# Altium schematic sheet Stepper.SchDoc
size A4
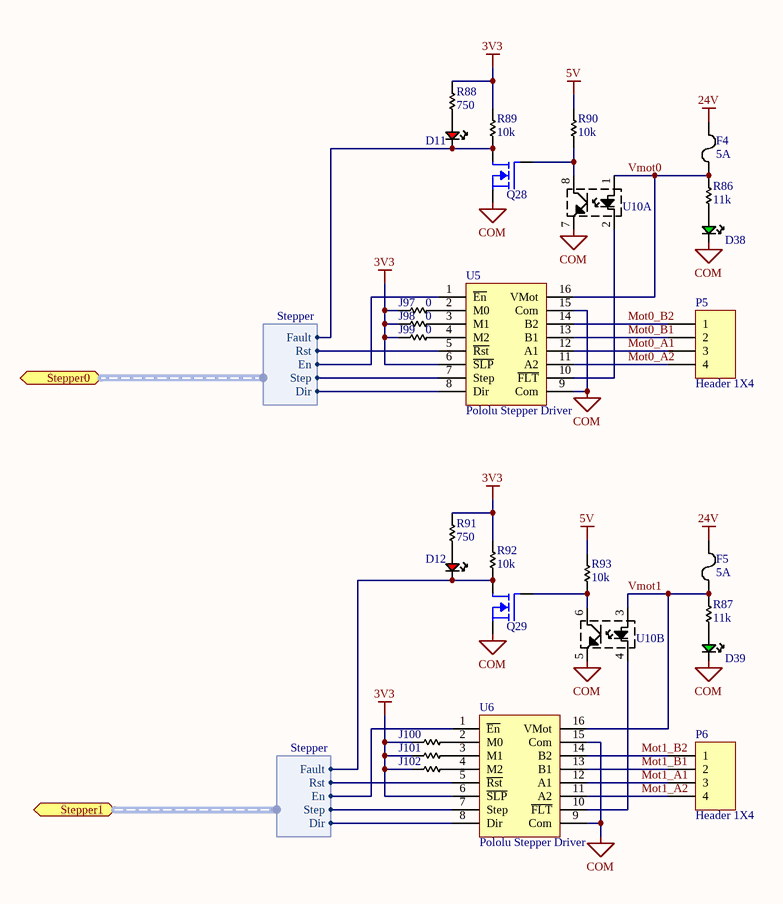
[diagram p0: Stepper.SchDoc]

## Parts
D11  Red  [0805 - Led Red]  (value not drawn)
D12  Red  [0805 - Led Red]  (value not drawn)
D38  Green  [0603 - Led Green]  (value not drawn)
D39  Green  [0603 - Led Green]  (value not drawn)
F4  value 5A  [Fuse - 1206]  (hidden comment: Fuse)
F5  value 5A  [Fuse - 1206]  (hidden comment: Fuse)
J97  value 0  [0805 - Resistor]  (hidden comment: Res)
J98  value 0  [0805 - Resistor]  (hidden comment: Res)
J99  value 0  [0805 - Resistor]  (hidden comment: Res)
J100  Res  [0805 - Resistor]  (value not drawn)
J101  Res  [0805 - Resistor]  (value not drawn)
J102  Res  [0805 - Resistor]  (value not drawn)
P5  Header 1X4  [Headers - 1x4 - Vertical - Lock]
P6  Header 1X4  [Headers - 1x4 - Vertical - Lock]
Q28  MOSFET_N  [SOT23-3]  (value not drawn)
Q29  MOSFET_N  [SOT23-3]  (value not drawn)
R86  value 11k  [0805 - Resistor]  (hidden comment: Res)
R87  value 11k  [0805 - Resistor]  (hidden comment: Res)
R88  value 750  [0805 - Resistor]  (hidden comment: Res)
R89  value 10k  [0805 - Resistor]  (hidden comment: Res)
R90  value 10k  [0805 - Resistor]  (hidden comment: Res)
R91  value 750  [0805 - Resistor]  (hidden comment: Res)
R92  value 10k  [0805 - Resistor]  (hidden comment: Res)
R93  value 10k  [0805 - Resistor]  (hidden comment: Res)
U5  Pololu Stepper Driver  [Pololu - DRV8825 - socket]
U6  Pololu Stepper Driver  [Pololu - DRV8825 - socket]
U10  LTV-827S-TA1  [8-SMD - GullWing]  (value not drawn)  (parts A,B of 2)

## Ports
Stepper0 (harness Stepper), Stepper1 (harness Stepper)

## Harnesses
Stepper: Dir, Step, En, Rst, Fault

## Nets
3V3: J97.2 J98.2 J99.2 J100.2 J101.2 J102.2 R88.2 R89.1 R91.2 R92.1 U5.6(~{SLP}) U6.6(~{SLP})
5V: R90.1 R93.1
24V: F4.1 F5.1
COM: D38.2(K) D39.2(K) Q28.2(S) Q29.2(S) U5.9(Com) U5.15(Com) U6.9(Com) U6.15(Com) U10.5(E2) U10.7(E1)
Mot0_A1: P5.3 U5.12(A1)
Mot0_A2: P5.4 U5.11(A2)
Mot0_B1: P5.2 U5.13(B1)
Mot0_B2: P5.1 U5.14(B2)
Mot1_A1: P6.3 U6.12(A1)
Mot1_A2: P6.4 U6.11(A2)
Mot1_B1: P6.2 U6.13(B1)
Mot1_B2: P6.1 U6.14(B2)
Vmot0: F4.2 R86.2 U5.16(VMot) U10.1(A1)
Vmot1: F5.2 R87.2 U6.16(VMot) U10.3(A2)
NetD11_1: D11.1(A) R88.1
NetD11_2: D11.2(K) Q28.3(D) R89.2 ; port Stepper0.Fault
NetD12_1: D12.1(A) R91.1
NetD12_2: D12.2(K) Q29.3(D) R92.2 ; port Stepper1.Fault
NetD38_1: D38.1(A) R86.1
NetD39_1: D39.1(A) R87.1
NetJ97_1: J97.1 U5.2(M0)
NetJ98_1: J98.1 U5.3(M1)
NetJ99_1: J99.1 U5.4(M2)
NetJ100_1: J100.1 U6.2(M0)
NetJ101_1: J101.1 U6.3(M1)
NetJ102_1: J102.1 U6.4(M2)
NetQ28_1: Q28.1(G) R90.2 U10.8(C1)
NetQ29_1: Q29.1(G) R93.2 U10.6(C2)
NetU5_1: U5.1(~{En}) ; port Stepper0.En
NetU5_5: U5.5(~{Rst}) ; port Stepper0.Rst
NetU5_7: U5.7(Step) ; port Stepper0.Step
NetU5_8: U5.8(Dir) ; port Stepper0.Dir
NetU5_10: U5.10(~{FLT}) U10.2(K1)
NetU6_1: U6.1(~{En}) ; port Stepper1.En
NetU6_5: U6.5(~{Rst}) ; port Stepper1.Rst
NetU6_7: U6.7(Step) ; port Stepper1.Step
NetU6_8: U6.8(Dir) ; port Stepper1.Dir
NetU6_10: U6.10(~{FLT}) U10.4(K2)

## Library data of the parts
D11 D12 = LED-Red-2mA-lowBrigthness-0805: LED 630NM RED WTR CLR 0805 SMD; Manufacturer: Rohm semiconductor; Manufacturer No: SML-211UTT86; Sub Category: 0805; Voltage: 1.8V; Current: 2mA; Part Number: LED-Red-2mA-lowBrigthness-0805; Category: LED; Pin count: 2; Package: 0805; Supplier 1: Digi-Key; Supplier Part Number 1: 511-1292-1-ND; ComponentLink1URL: http://rohmfs.rohm.com/en/products/databook/datasheet/opto/led/chip_mono/sml-21.pdf; ComponentLink1Description: Datasheet; Creation Date: 2013-11-19 15:30:55; Created by: Pier-Yves; Value: red; Height: 0.8mm
D38 D39 = LED-Green-2mA-lowBrigthness-0603: LED SMARTLED GREEN 570NM 0603; Manufacturer: OSRAM Opto Semiconductor; Manufacturer No: LG L29K-G2J1-24-Z; Sub Category: 0603; Value: 3.92 mcd; Voltage: 1.7V; Current: 2mA; Part Number: LED-Green-2mA-lowBrigthness-0603; Category: LED; Pin count: 2; Package: 0603; Series: SmartLED; Supplier 1: Digi-Key; Supplier Part Number 1: 475-2709-1-ND; ComponentLink1URL: http://catalog.osram-os.com/catalogue/catalogue.do;jsessionid=32CB61882C089EDD4B6D0A54E7E1F117?act=downloadFile&favOid=020000020000138e000100b6; ComponentLink1Description: Datasheet; Creation Date: 2013-11-17 11:13:55; Created by: Pier-Yves; Height: 0.65mm
F4 F5 = Fuse-1206-Bourns-Slow-SinglFuse_SF-1206S-5A: FUSE SLOW 24VDC 5A 1206; Manufacturer: Bourns Inc.; Manufacturer No: SF-1206S500-2; Sub Category: 1206 SlowBlow; Voltage: 63VDC; Part Number: Fuse-1206-Bourns-Slow-SinglFuse_SF-1206S-5A; Category: Fuse; Pin count: 2; Package: 1206; Series: SinglFuse SF-1206S; Supplier 1: Digi-Key; Supplier Part Number 1: SF-1206S500-2CT-ND; ComponentLink1URL: http://www.bourns.com/data/global/pdfs/sf1206s.pdf; ComponentLink1Description: Datasheet; Creation Date: 2013-11-18 20:50:29; Created by: Pier-Yves; Height: 0.6mm; Current: 5A; Temperature: -40°C ~ 105°C
J97-J99 = Jumper-0805: RES 0.0 OHM 1/8W JUMP 0805; Manufacturer: Stackpole electronic; Manufacturer No: RMCF0805ZT0R00; Sub Category: 0805; Current: 2A; Part Number: Jumper-0805; Category: Resistor; Pin count: 2; Package: 0805; Series: RMFC; Supplier 1: Digi-Key; Supplier Part Number 1: RMCF0805ZT0R00CT-ND; ComponentLink1URL: http://www.seielect.com/Catalog/SEI-RMCF_RMCP.pdf; ComponentLink1Description: Datasheet; Creation Date: 2013-09-21 02:33:24; Created by: Pier-Yves; Power: 1/8W; Height: 0.65mm
J100-J102 = Jumper-0805: RES 0.0 OHM 1/8W JUMP 0805; Manufacturer: Stackpole electronic; Manufacturer No: RMCF0805ZT0R00; Sub Category: 0805; Value: 0; Current: 2A; Part Number: Jumper-0805; Category: Resistor; Pin count: 2; Package: 0805; Series: RMFC; Supplier 1: Digi-Key; Supplier Part Number 1: RMCF0805ZT0R00CT-ND; ComponentLink1URL: http://www.seielect.com/Catalog/SEI-RMCF_RMCP.pdf; ComponentLink1Description: Datasheet; Creation Date: 2013-09-21 02:33:24; Created by: Pier-Yves; Power: 1/8W; Height: 0.65mm
P5 P6 = Header-0.100-Vertical-Lock-1X4: CONN HEADER 4POS .100" STR TIN; Manufacturer: Molex Inc; Manufacturer No: 90136-1104; Sub Category: 100mils Vertical lock; Value: 4 pins; LatestRevisionDate: 17-Jul-2002; LatestRevisionNote: Re-released for DXP Platform.; Publisher: Altium Limited; Part Number: Header-0.100-Vertical-Lock-1X4; Category: Header; Pin count: 4; Series: C-Grid III 90136; Supplier 1: Digi-Key; Supplier Part Number 1: WM8215-ND; ComponentLink1URL: http://www.molex.com/pdm_docs/sd/901361104_sd.pdf; ComponentLink1Description: Datasheet; Creation Date: 2013-11-05 17:17:54; Created by: Pier-Yves; Height: 10.9mm
Q28 Q29 = 2N7002: MosFET Channel-N SOT-23-3 3.3A; Part Number: 2N7002; Manufacturer: Vishay Siliconix; Manufacturer No: SI2304DDS-T1-GE3; Sub Category: MOSFET-N; Value: Channel N; Power: 1.7W; Voltage: 30V; Category: Transistor; Pin count: 3; Package: SOT-23-3; Series: ÉTrenchFET; Supplier 1: Digi-Key; Supplier Part Number 1: SI2304DDS-T1-GE3CT-ND; ComponentLink1URL: http://www.vishay.com/docs/65175/si2304dd.pdf; ComponentLink1Description: Datasheet; Creation Date: 2013-06-28 13:51:31; Created by: Pier-Yves; Current: 3.3A
R86 R87 = Yagao-RC0805-11k: RES 11K OHM 1/8W 5% 0805 SMD; Manufacturer: Yagao; Manufacturer No: RC0805JR-0711KL; Sub Category: 0805; Part Number: Yagao-RC0805-11k; Category: Resistor; Pin count: 2; Package: 0805; Series: RC0805; Supplier 1: Digi-Key; Supplier Part Number 1: 311-11KARCT-ND; ComponentLink1URL: http://media.digikey.com/pdf/Data%20Sheets/Yageo%20PDFs/RC0805%20Pb%20Free.pdf; ComponentLink1Description: Datasheet; Creation Date: 2013-06-28 03:21:03; Created by: Pier-Yves; Tolerance: 5%; Power: 1/8W; Height: 0.6mm
R88 R91 = Yagao-RC0805-750: RES 750 OHM 1/8W 5% 0805 SMD; Manufacturer: Yagao; Manufacturer No: RC0805JR-07750RL; Sub Category: 0805; Part Number: Yagao-RC0805-750; Category: Resistor; Pin count: 2; Package: 0805; Series: RC0805; Supplier 1: Digi-Key; Supplier Part Number 1: 311-750ARCT-ND; ComponentLink1URL: http://media.digikey.com/pdf/Data%20Sheets/Yageo%20PDFs/RC0805%20Pb%20Free.pdf; ComponentLink1Description: Datasheet; Creation Date: 2013-06-28 03:21:03; Created by: Pier-Yves; Tolerance: 5%; Power: 1/8W; Height: 0.6mm
R89 R90 R92 R93 = Yagao-RC0805-10k: RES 10K OHM 1/8W 5% 0805 SMD; Manufacturer: Yagao; Manufacturer No: RC0805JR-0710KL; Sub Category: 0805; Part Number: Yagao-RC0805-10k; Category: Resistor; Pin count: 2; Package: 0805; Series: RC0805; Supplier 1: Digi-Key; Supplier Part Number 1: 311-10KARCT-ND; ComponentLink1URL: http://media.digikey.com/pdf/Data%20Sheets/Yageo%20PDFs/RC0805%20Pb%20Free.pdf; ComponentLink1Description: Datasheet; Creation Date: 2013-06-28 03:21:03; Created by: Pier-Yves; Tolerance: 5%; Power: 1/8W; Height: 0.6mm
U5 U6 = Pololu-DRV8825-BiPolar-HighCurrent: Pololu 4 phase stepper driver 1/32 step; Manufacturer No: 2133; Value: 1.5A /phase; Voltage: 8.2V ~ 45V; Current: 1.5A; Part Number: Pololu-DRV8825-BiPolar-HighCurrent; Category: Module; Sub Category: Stepper Driver; Pin count: 16; Manufacturer: Pololu; Supplier 1: Pololu; Supplier Part Number 1: 2133; ComponentLink1URL: http://www.pololu.com/file/0J603/drv8824-drv8825-stepper-motor-driver-carrier-schematic-diagram.pdf; ComponentLink1Description: Datasheet; Creation Date: 2013-10-25 13:52:54; Created by: Pier-Yves; Temperature: –40°C to 150°C
U10 = LTV-827S-TA1: OPTOCOUPLER TRANS 5KVRMS 8SMD; Manufacturer: Lite-On; Power: 2ch; Voltage: 35V; Current: 50mA; Part Number: LTV-827S-TA1; Category: Optocoupler; Pin count: 8; Package: 8-SMD; Manufacturer No: LTV-827S-TA1; Supplier 1: Digi-Key; Supplier Part Number 1: 160-2040-1-ND; ComponentLink1URL: http://media.digikey.com/pdf/Data%20Sheets/Lite-On%20PDFs/LTV-817_827_847(M,S,S_TA1).pdf; ComponentLink1Description: Datasheet; Creation Date: 2013-11-19 14:59:51; Created by: Pier-Yves; Height: 3.5mm